# Altium project OSSI-1 Battery Board.PrjPcb
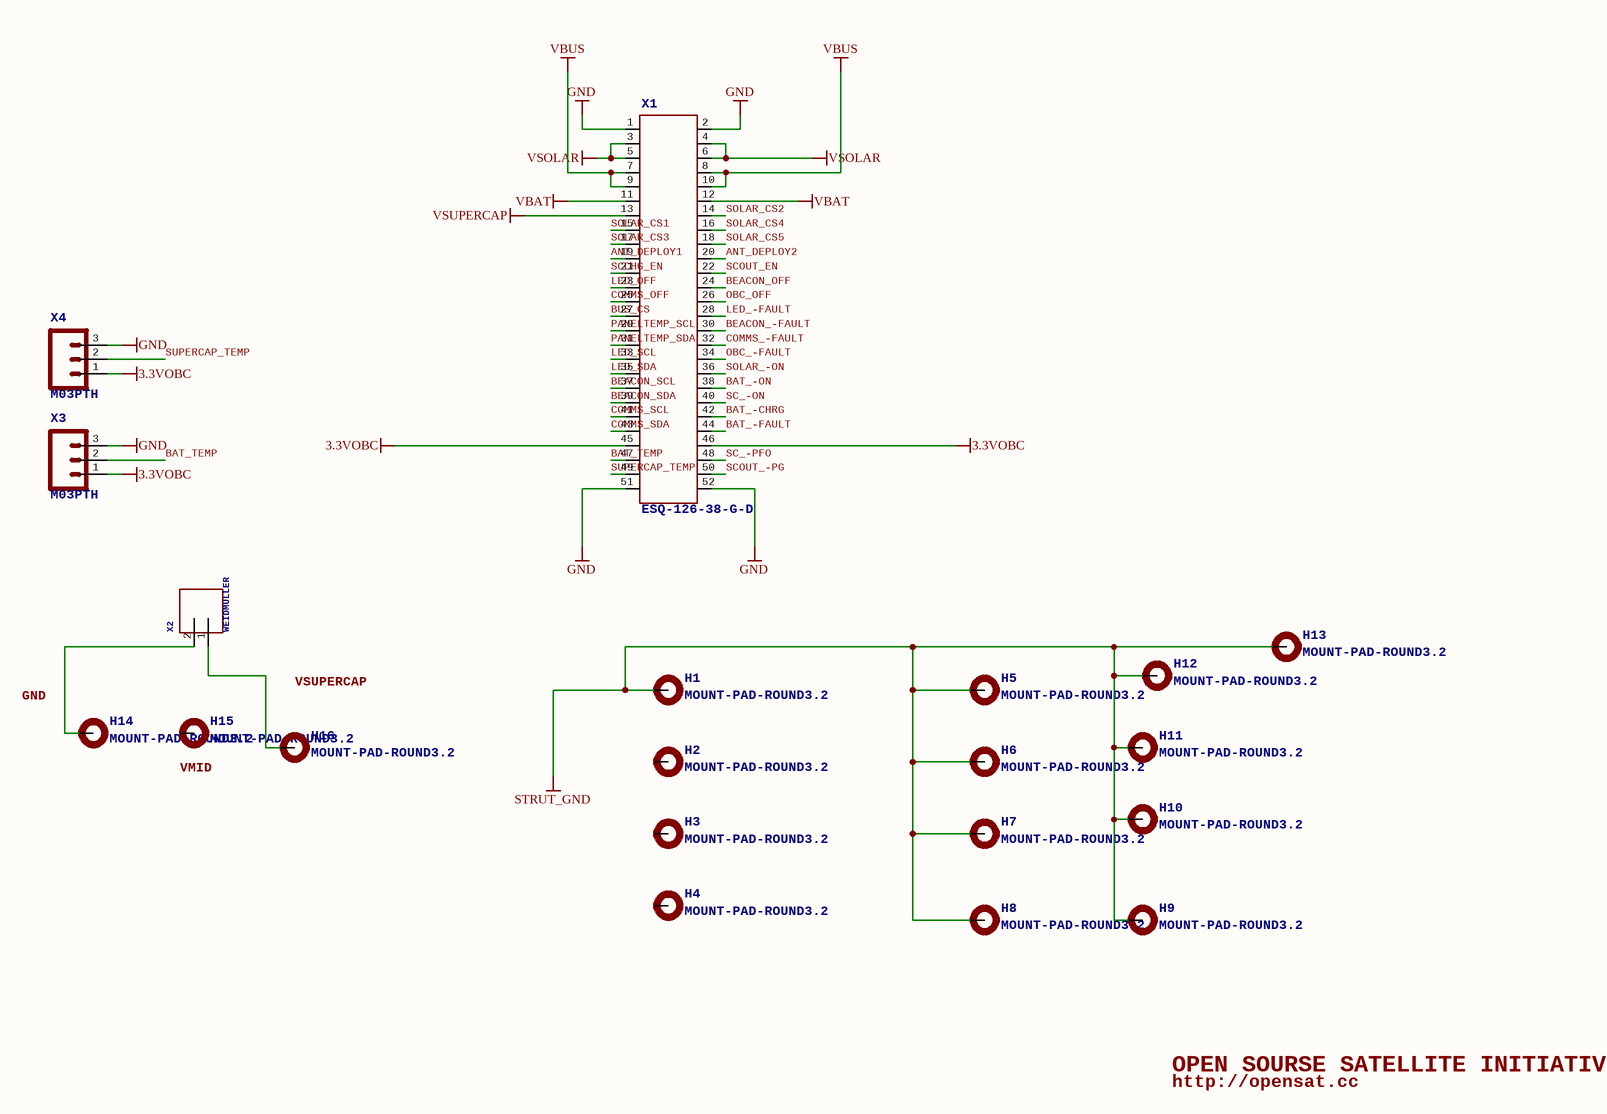
[diagram p0: OSSI-1 Battery Board.SchDoc]
1 sheet, 20 parts. Net scope: global (net labels, ports and power ports of the same name join across sheets).
Board file: OSSI-1 Battery Board.PcbDoc

## Sheet OSSI-1 Battery Board.SchDoc: TITLE:
size 410 x 286 mm; Date: Date:; >LAST_DATE_TIME: 01/11/2015 13:08:42; Sheet:: Sheet:; >SHEET: 1; REV:: REV:; Document Number:: Document Number:; >DRAWING_NAME: OSSI-1 Battery Board.sch

### Parts
H1  >NAME: H1  [3.2-PAD-ROUND]  (hidden comment: MOUNT-PAD-ROUND3.2)
H2  >NAME: H2  [3.2-PAD-ROUND]  (hidden comment: MOUNT-PAD-ROUND3.2)
H3  >NAME: H3  [3.2-PAD-ROUND]  (hidden comment: MOUNT-PAD-ROUND3.2)
H4  >NAME: H4  [3.2-PAD-ROUND]  (hidden comment: MOUNT-PAD-ROUND3.2)
H5  >NAME: H5  [3.2-PAD-ROUND]  (hidden comment: MOUNT-PAD-ROUND3.2)
H6  >NAME: H6  [3.2-PAD-ROUND]  (hidden comment: MOUNT-PAD-ROUND3.2)
H7  >NAME: H7  [3.2-PAD-ROUND]  (hidden comment: MOUNT-PAD-ROUND3.2)
H8  >NAME: H8  [3.2-PAD-ROUND]  (hidden comment: MOUNT-PAD-ROUND3.2)
H9  >NAME: H9  [3.2-PAD-ROUND]  (hidden comment: MOUNT-PAD-ROUND3.2)
H10  >NAME: H10  [3.2-PAD-ROUND]  (hidden comment: MOUNT-PAD-ROUND3.2)
H11  >NAME: H11  [3.2-PAD-ROUND]  (hidden comment: MOUNT-PAD-ROUND3.2)
H12  >NAME: H12  [3.2-PAD-ROUND]  (hidden comment: MOUNT-PAD-ROUND3.2)
H13  >NAME: H13  [3.2-PAD-ROUND]  (hidden comment: MOUNT-PAD-ROUND3.2)
H14  >NAME: H14  [3.2-PAD-ROUND]  (hidden comment: MOUNT-PAD-ROUND3.2)
H15  >NAME: H15  [3.2-PAD-ROUND]  (hidden comment: MOUNT-PAD-ROUND3.2)
H16  >NAME: H16  [3.2-PAD-ROUND]  (hidden comment: MOUNT-PAD-ROUND3.2)
X1  >NAME: X1  [ESQ-126-XX-X-D]  (hidden comment: ESQ-126-38-G-D)
X2  >NAME: X2  [WEIDMULLER1760490000]  (hidden comment: WEIDMULLER)
X3  >NAME: X3  [1X03]  (hidden comment: M03PTH)
X4  >NAME: X4  [1X03]  (hidden comment: M03PTH)

### Nets
3.3VOBC: X1.45 X1.46 X3.1 X4.1
GND: X1.1 X1.2 X1.51 X1.52 X3.3 X4.3
STRUT_GND: H1.B3,2(MOUNT) H5.B3,2(MOUNT) H6.B3,2(MOUNT) H7.B3,2(MOUNT) H8.B3,2(MOUNT) H9.B3,2(MOUNT) H10.B3,2(MOUNT) H11.B3,2(MOUNT) H12.B3,2(MOUNT) H13.B3,2(MOUNT)
VBAT: X1.11 X1.12
VBUS: X1.7 X1.8 X1.9 X1.10
VSOLAR: X1.3 X1.4 X1.5 X1.6
VSUPERCAP: X1.13
ANT_DEPLOY1: X1.19
ANT_DEPLOY2: X1.20
BAT_-CHRG: X1.42
BAT_-FAULT: X1.44
BAT_-ON: X1.38
BAT_TEMP: X1.47 X3.2
BEACON_-FAULT: X1.30
BEACON_OFF: X1.24
BEACON_SCL: X1.37
BEACON_SDA: X1.39
BUS_CS: X1.27
COMMS_-FAULT: X1.32
COMMS_OFF: X1.25
COMMS_SCL: X1.41
COMMS_SDA: X1.43
LED_-FAULT: X1.28
LED_OFF: X1.23
LED_SCL: X1.33
LED_SDA: X1.35
OBC_-FAULT: X1.34
OBC_OFF: X1.26
PANELTEMP_SCL: X1.29
PANELTEMP_SDA: X1.31
SC_-ON: X1.40
SC_-PFO: X1.48
SCCHG_EN: X1.21
SCOUT_-PG: X1.50
SCOUT_EN: X1.22
SOLAR_-ON: X1.36
SOLAR_CS1: X1.15
SOLAR_CS2: X1.14
SOLAR_CS3: X1.17
SOLAR_CS4: X1.16
SOLAR_CS5: X1.18
SUPERCAP_TEMP: X1.49 X4.2
NetH14_B3,2: H14.B3,2(MOUNT) X2.2
NetH16_B3,2: H16.B3,2(MOUNT) X2.1

Not connected (* = marked no-connect by the designer): H2 B3,2(MOUNT); H3 B3,2(MOUNT); H4 B3,2(MOUNT); H15 B3,2(MOUNT)

### Notes on the sheet
- GND
- VSUPERCAP
- (near H15) VMID
- OPEN SOURSE SATELLITE INITIATIVE
- http://opensat.cc

### Library data of the parts
X1 = ESQ-126-38-G-D: <b>Samtec ESQ-126-XX-G-D Elevated Sockets Seires</b> / <ul> / <li> ESQ-126-37-G-D</li> / <li> ESQ-126-38-G-D</li> / <li> ESQ-126-39-G-D</li> / </ul>; >VALUE: ESQ-126-38-G-D
X3 X4 = M03PTH: <b>Header 3</b> / Standard 3-pin 0.1" header. Use with straight break away headers (SKU : PRT-00116), right angle break away headers (PRT-00553), swiss pins (PRT-00743), machine pins (PRT-00117), and female headers (PRT-00115). Molex polarized connector foot print use with SKU : PRT-08232 with associated crimp pins and housings.; >VALUE: M03PTH
H1-H16 = MOUNT-PAD-ROUND3.2: >VALUE: MOUNT-PAD-ROUND3.2
X2 = WEIDMULLER: >VALUE: WEIDMULLER